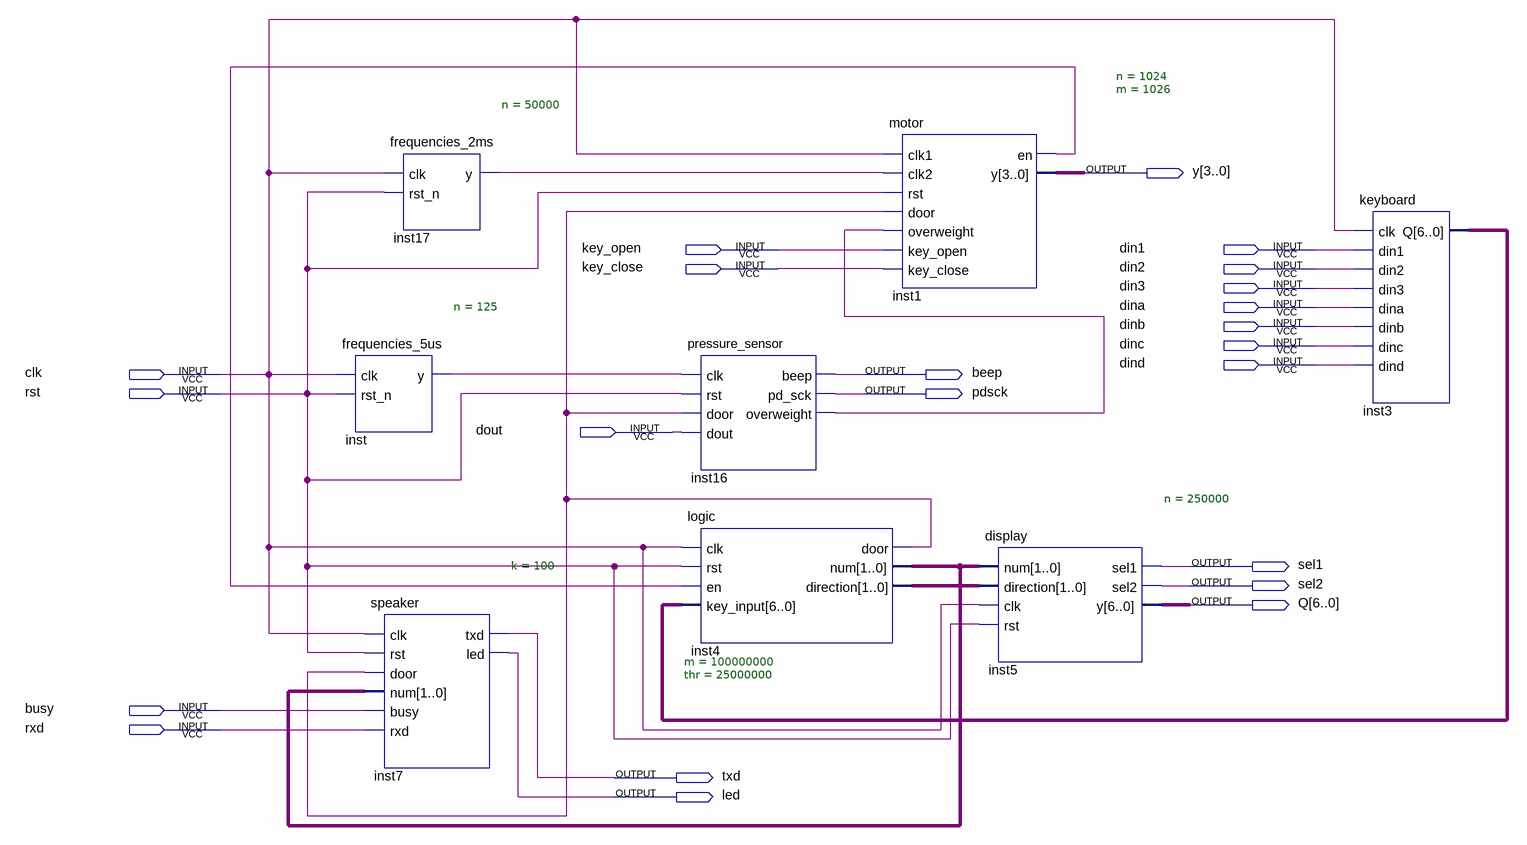
[diagram p0: schematic sheet]
// Quartus schematic block1.bdf as structural Verilog: 8 symbols, 22 pins
module block1 (
  input  key_open,
  input  din1,
  input  key_close,
  input  din2,
  input  din3,
  input  dina,
  input  dinb,
  input  dinc,
  input  dind,
  input  clk,
  input  rst,
  input  dout,
  input  busy,
  input  rxd,
  output [3:0] y,
  output beep,
  output pdsck,
  output sel1,
  output sel2,
  output [6:0] Q,
  output txd,
  output led
);

  wire inst1_en, inst4_door, inst16_overweight, inst17_y, inst_y;
  wire [1:0] inst4_direction, inst4_num;
  wire [6:0] inst3_q;

  frequencies_5us #(.n(125)) inst (.clk(clk), .rst_n(rst), .y(inst_y));
  frequencies_2ms #(.n(50000)) inst17 (.clk(clk), .rst_n(rst), .y(inst17_y));
  speaker #(.k(100)) inst7 (
    .clk(clk), .rst(rst), .door(inst4_door), .num(inst4_num), .busy(busy), .rxd(rxd), .txd(txd), .led(led));
  pressure_sensor inst16 (
    .clk(inst_y), .rst(rst), .door(inst4_door), .dout(dout), .beep(beep), .pd_sck(pdsck),
    .overweight(inst16_overweight));
  \logic  #(.m(100000000), .thr(25000000)) inst4 (
    .clk(clk), .rst(rst), .en(inst1_en), .key_input(inst3_q), .door(inst4_door), .num(inst4_num),
    .direction(inst4_direction));
  motor #(.n(1024), .m(1026)) inst1 (
    .clk1(clk), .clk2(inst17_y), .rst(rst), .door(inst4_door), .overweight(inst16_overweight),
    .key_open(key_open), .key_close(key_close), .en(inst1_en), .y(y));
  display #(.n(250000)) inst5 (
    .num(inst4_num), .direction(inst4_direction), .clk(clk), .rst(rst), .sel1(sel1), .sel2(sel2), .y(Q));
  keyboard inst3 (
    .clk(clk), .din1(din1), .din2(din2), .din3(din3), .dina(dina), .dinb(dinb), .dinc(dinc), .dind(dind),
    .Q(inst3_q));
endmodule
